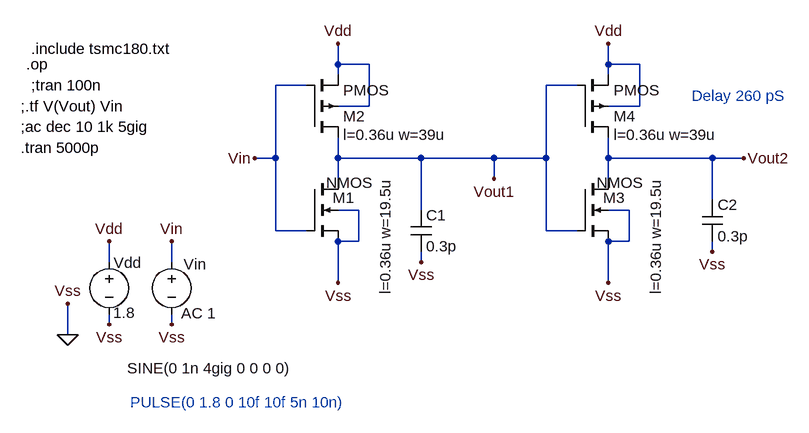
[diagram p0: schematic Delay Cell Active comp_3.asc]
Delay Cell Active comp_3.asc, the LTspice schematic file:
Version 4
SHEET 1 1204 680
WIRE 496 -96 496 -128
WIRE 544 -96 496 -96
WIRE 912 -96 912 -128
WIRE 960 -96 912 -96
WIRE 496 -80 496 -96
WIRE 912 -80 912 -96
WIRE 448 -64 400 -64
WIRE 864 -64 816 -64
WIRE 544 -32 544 -96
WIRE 544 -32 496 -32
WIRE 960 -32 960 -96
WIRE 960 -32 912 -32
WIRE 400 48 400 -64
WIRE 400 48 368 48
WIRE 496 48 496 16
WIRE 624 48 496 48
WIRE 736 48 624 48
WIRE 816 48 816 -64
WIRE 816 48 736 48
WIRE 912 48 912 16
WIRE 1072 48 912 48
WIRE 1120 48 1072 48
WIRE 496 80 496 48
WIRE 736 80 736 48
WIRE 912 80 912 48
WIRE 1072 112 1072 48
WIRE 528 128 496 128
WIRE 624 128 624 48
WIRE 944 128 912 128
WIRE 400 160 400 48
WIRE 448 160 400 160
WIRE 816 160 816 48
WIRE 864 160 816 160
WIRE 528 176 528 128
WIRE 528 176 496 176
WIRE 944 176 944 128
WIRE 944 176 912 176
WIRE 1072 192 1072 176
WIRE 144 208 144 176
WIRE 240 208 240 176
WIRE 624 208 624 192
WIRE 496 240 496 176
WIRE 912 240 912 176
WIRE 144 304 144 288
WIRE 240 304 240 288
WIRE 80 320 80 272
FLAG 80 320 0
FLAG 80 272 Vss
FLAG 240 176 Vin
FLAG 144 304 Vss
FLAG 240 304 Vss
FLAG 144 176 Vdd
FLAG 496 -128 Vdd
FLAG 496 240 Vss
FLAG 624 208 Vss
FLAG 368 48 Vin
FLAG 912 -128 Vdd
FLAG 912 240 Vss
FLAG 1120 48 Vout2
FLAG 1072 192 Vss
FLAG 736 80 Vout1
SYMBOL nmos4 448 80 R0
WINDOW 0 40 29 Left 2
WINDOW 3 30 6 Left 2
WINDOW 123 121 -2 VRight 2
SYMATTR InstName M1
SYMATTR Value2 l=0.36u w=19.5u
SYMBOL voltage 144 192 R0
WINDOW 123 0 0 Left 0
WINDOW 39 0 0 Left 0
WINDOW 0 7 17 Left 2
WINDOW 3 6 94 Left 2
SYMATTR InstName Vdd
SYMATTR Value 1.8
SYMBOL voltage 240 192 R0
WINDOW 0 19 19 Left 2
WINDOW 3 -68 179 Left 2
WINDOW 123 15 95 Left 2
WINDOW 39 0 0 Left 0
SYMATTR InstName Vin
SYMATTR Value SINE(0 1n 4gig 0 0 0 0)
SYMATTR Value2 AC 1
SYMBOL cap 608 128 R0
SYMATTR InstName C1
SYMATTR Value 0.3p
SYMBOL pmos4 448 16 M180
WINDOW 123 56 4 Left 2
SYMATTR Value2 l=0.36u w=39u
SYMATTR InstName M2
SYMBOL nmos4 864 80 R0
WINDOW 0 40 29 Left 2
WINDOW 3 30 6 Left 2
WINDOW 123 121 -2 VRight 2
SYMATTR InstName M3
SYMATTR Value2 l=0.36u w=19.5u
SYMBOL pmos4 864 16 M180
WINDOW 123 56 4 Left 2
SYMATTR Value2 l=0.36u w=39u
SYMATTR InstName M4
SYMBOL cap 1056 112 R0
SYMATTR InstName C2
SYMATTR Value 0.3p
TEXT 24 -120 Left 2 !.include tsmc180.txt
TEXT 16 -96 Left 2 !.op
TEXT 8 -32 Left 2 !;.tf V(Vout) Vin
TEXT 8 0 Left 2 !;ac dec 10 1k 5gig
TEXT 8 32 Left 2 !.tran 5000p
TEXT 24 -64 Left 2 !;tran 100n
TEXT 1040 -48 Left 2 ;Delay 260 pS
TEXT 176 424 Left 2 ;PULSE(0 1.8 0 10f 10f 5n 10n)

The netlist it stands for:
* Delay Cell Active comp_3.asc
M1 Vout1 Vin 0 0 NMOS l=0.36u w=19.5u
Vdd Vdd 0 1.8
Vin Vin 0 SINE(0 1n 4gig 0 0 0 0) AC 1
C1 Vout1 0 0.3p
M2 Vout1 Vin Vdd Vdd PMOS l=0.36u w=39u
M3 Vout2 Vout1 0 0 NMOS l=0.36u w=19.5u
M4 Vout2 Vout1 Vdd Vdd PMOS l=0.36u w=39u
C2 Vout2 0 0.3p
.model NMOS NMOS
.model PMOS PMOS
.lib standard.mos
.include tsmc180.txt
.op
;.tf V(Vout) Vin
;ac dec 10 1k 5gig
.tran 5000p
;tran 100n
* Delay 260 pS
* PULSE(0 1.8 0 10f 10f 5n 10n)
.backanno
.end